# EAGLE design Arc Reactor (EAGLE 7.2.0)
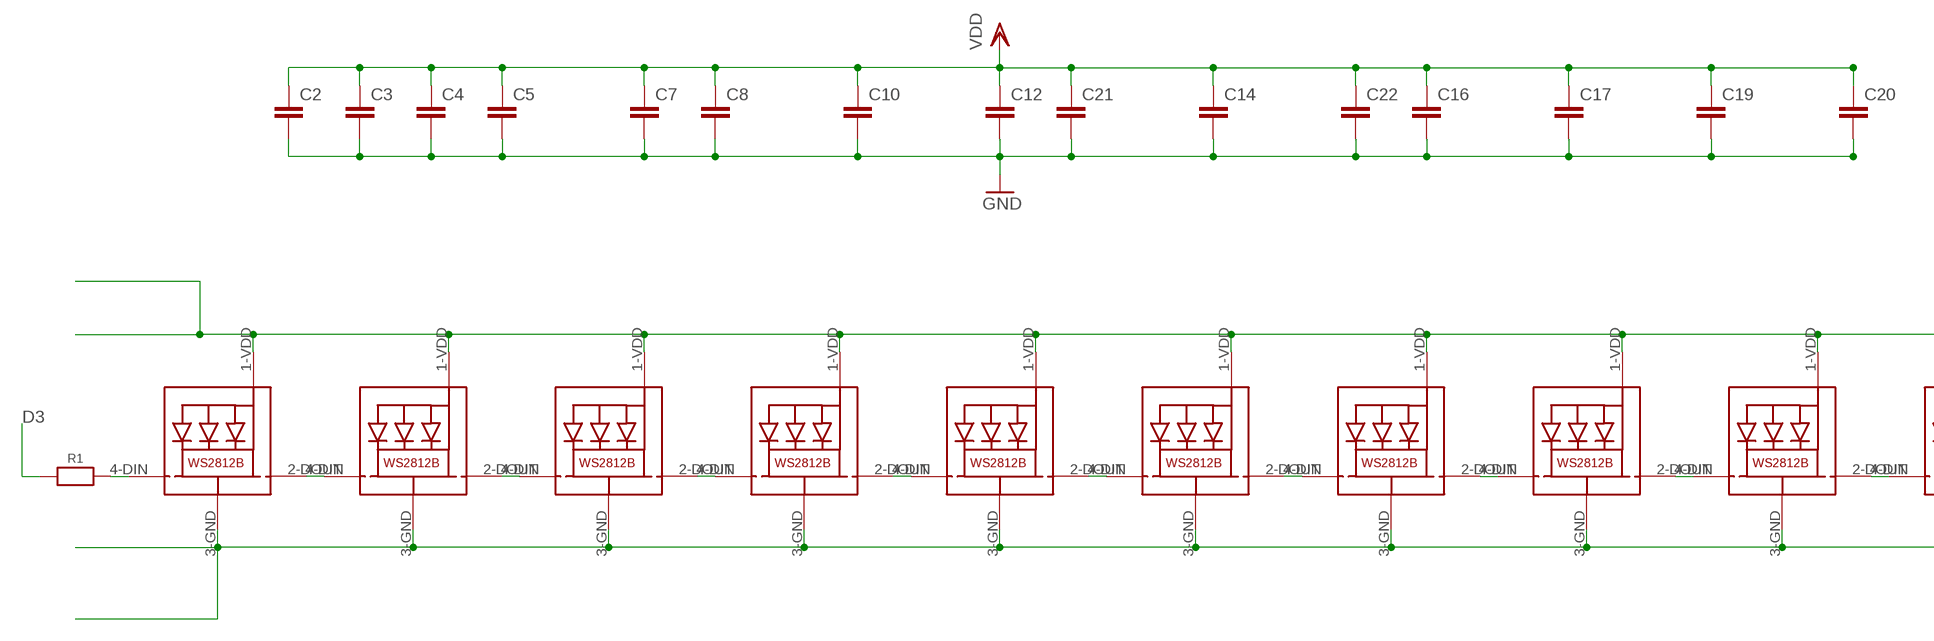
[diagram p0: schematic, sheet 1, part 1 of 2]
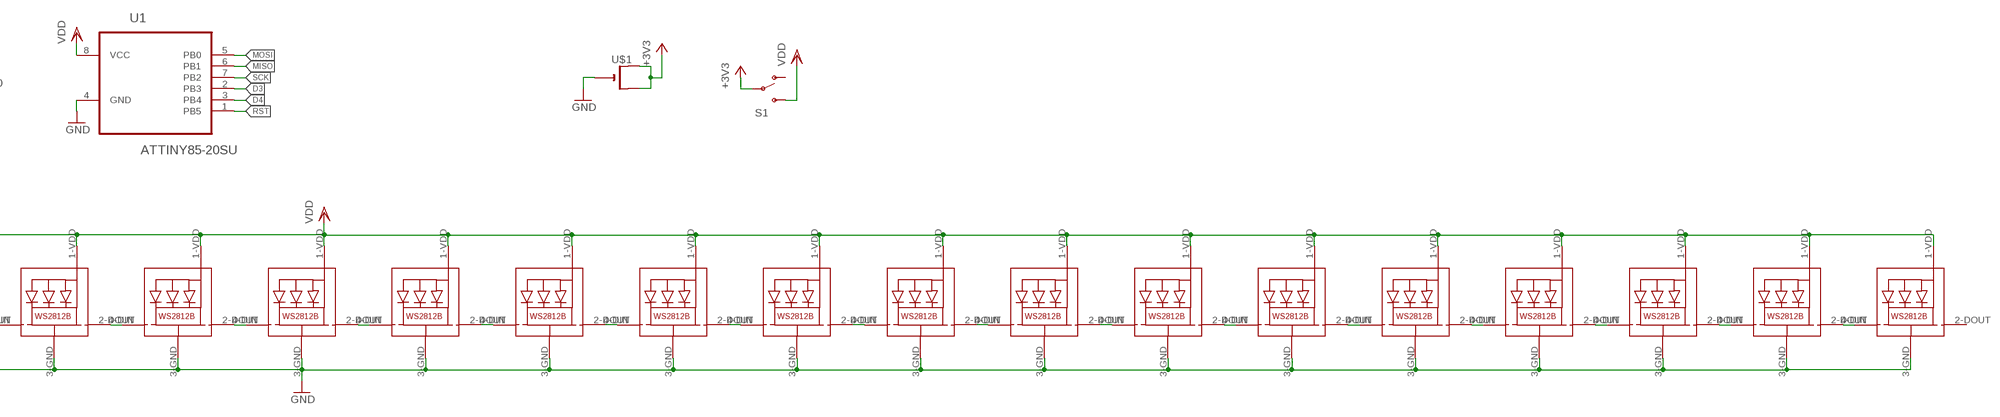
[diagram p1: schematic, sheet 1, part 2 of 2]

## Parts
C2  C-EUC0603  [C0603]
C3  C-EUC0603  [C0603]
C4  C-EUC0603  [C0603]
C5  C-EUC0603  [C0603]
C7  C-EUC0603  [C0603]
C8  C-EUC0603  [C0603]
C10  C-EUC0603  [C0603]
C12  C-EUC0603  [C0603]
C14  C-EUC0603  [C0603]
C16  C-EUC0603  [C0603]
C17  C-EUC0603  [C0603]
C19  C-EUC0603  [C0603]
C20  C-EUC0603  [C0603]
C21  C-EUC0603  [C0603]
C22  C-EUC0603  [C0603]
LED1  WS2812B5050  [WS2812B]
LED3  WS2812B5050  [WS2812B]
LED4  WS2812B5050  [WS2812B]
LED5  WS2812B5050  [WS2812B]
LED6  WS2812B5050  [WS2812B]
LED7  WS2812B5050  [WS2812B]
LED8  WS2812B5050  [WS2812B]
LED9  WS2812B5050  [WS2812B]
LED10  WS2812B5050  [WS2812B]
LED11  WS2812B5050  [WS2812B]
LED12  WS2812B5050  [WS2812B]
LED13  WS2812B5050  [WS2812B]
LED14  WS2812B5050  [WS2812B]
LED15  WS2812B5050  [WS2812B]
LED16  WS2812B5050  [WS2812B]
LED17  WS2812B5050  [WS2812B]
LED18  WS2812B5050  [WS2812B]
LED19  WS2812B5050  [WS2812B]
LED20  WS2812B5050  [WS2812B]
LED21  WS2812B5050  [WS2812B]
LED22  WS2812B5050  [WS2812B]
LED23  WS2812B5050  [WS2812B]
LED24  WS2812B5050  [WS2812B]
LED25  WS2812B5050  [WS2812B]
LED26  WS2812B5050  [WS2812B]
R1  RESISTOR_0603_NOOUT  [0603-NO]
S1  SWITCH-SPDTSMD2  [SWITCH-SPDT-SMD]
U1  ATTINY85-20SU  [SOIC127P798X216-8N]
U$1  CR2032SMT  [CR2032-SMD]

## Nets
+3V3: S1.2(P) U$1.+$1(+) U$1.+$2(+1)
D3: R1.1 U1.2(PB3)
D4: U1.3(PB4)
GND: C2.2 C3.2 C4.2 C5.2 C7.2 C8.2 C10.2 C12.2 C14.2 C16.2 C17.2 C19.2 C20.2 C21.2 C22.2 LED1.3-GND(GND) LED3.3-GND(GND) LED4.3-GND(GND) LED5.3-GND(GND) LED6.3-GND(GND) LED7.3-GND(GND) LED8.3-GND(GND) LED9.3-GND(GND) LED10.3-GND(GND) LED11.3-GND(GND) LED12.3-GND(GND) LED13.3-GND(GND) LED14.3-GND(GND) LED15.3-GND(GND) LED16.3-GND(GND) LED17.3-GND(GND) LED18.3-GND(GND) LED19.3-GND(GND) LED20.3-GND(GND) LED21.3-GND(GND) LED22.3-GND(GND) LED23.3-GND(GND) LED24.3-GND(GND) LED25.3-GND(GND) LED26.3-GND(GND) U1.4(GND) U$1.-
MISO: U1.6(PB1)
MOSI: U1.5(PB0)
N$1: LED1.2-DOUT(DO) LED3.4-DIN(DI)
N$2: LED3.2-DOUT(DO) LED4.4-DIN(DI)
N$3: LED4.2-DOUT(DO) LED5.4-DIN(DI)
N$4: LED5.2-DOUT(DO) LED6.4-DIN(DI)
N$5: LED6.2-DOUT(DO) LED7.4-DIN(DI)
N$6: LED7.2-DOUT(DO) LED8.4-DIN(DI)
N$7: LED8.2-DOUT(DO) LED9.4-DIN(DI)
N$8: LED9.2-DOUT(DO) LED10.4-DIN(DI)
N$9: LED10.2-DOUT(DO) LED11.4-DIN(DI)
N$10: LED11.2-DOUT(DO) LED12.4-DIN(DI)
N$11: LED12.2-DOUT(DO) LED13.4-DIN(DI)
N$12: LED13.2-DOUT(DO) LED14.4-DIN(DI)
N$13: LED14.2-DOUT(DO) LED15.4-DIN(DI)
N$14: LED15.2-DOUT(DO) LED16.4-DIN(DI)
N$15: LED16.2-DOUT(DO) LED17.4-DIN(DI)
N$16: LED17.2-DOUT(DO) LED18.4-DIN(DI)
N$17: LED18.2-DOUT(DO) LED19.4-DIN(DI)
N$18: LED19.2-DOUT(DO) LED20.4-DIN(DI)
N$19: LED20.2-DOUT(DO) LED21.4-DIN(DI)
N$20: LED21.2-DOUT(DO) LED22.4-DIN(DI)
N$21: LED22.2-DOUT(DO) LED23.4-DIN(DI)
N$22: LED23.2-DOUT(DO) LED24.4-DIN(DI)
N$23: LED24.2-DOUT(DO) LED25.4-DIN(DI)
N$24: LED25.2-DOUT(DO) LED26.4-DIN(DI)
N$25: LED1.4-DIN(DI) R1.2
RST: U1.1(PB5)
SCK: U1.7(PB2)
VDD: C2.1 C3.1 C4.1 C5.1 C7.1 C8.1 C10.1 C12.1 C14.1 C16.1 C17.1 C19.1 C20.1 C21.1 C22.1 LED1.1-VDD(VDD) LED3.1-VDD(VDD) LED4.1-VDD(VDD) LED5.1-VDD(VDD) LED6.1-VDD(VDD) LED7.1-VDD(VDD) LED8.1-VDD(VDD) LED9.1-VDD(VDD) LED10.1-VDD(VDD) LED11.1-VDD(VDD) LED12.1-VDD(VDD) LED13.1-VDD(VDD) LED14.1-VDD(VDD) LED15.1-VDD(VDD) LED16.1-VDD(VDD) LED17.1-VDD(VDD) LED18.1-VDD(VDD) LED19.1-VDD(VDD) LED20.1-VDD(VDD) LED21.1-VDD(VDD) LED22.1-VDD(VDD) LED23.1-VDD(VDD) LED24.1-VDD(VDD) LED25.1-VDD(VDD) LED26.1-VDD(VDD) S1.3(S) U1.8(VCC)
Unconnected: LED26.2-DOUT(DO) S1.1(O)

## Library data of the parts
C2-C5 C7 C8 C10 C12 C14 C16 C17 C19-C22 = rcl:C-EU: CAPACITOR, European symbol
LED1 LED3-LED26 = microbuilder:WS2812B5050
R1 = microbuilder:RESISTOR: Resistors For new designs, use the packages preceded by an '_' character since they are more reliable: The following footprints should be used on most boards: _0402 - Standard footprint for regular board layouts _0603 - Standard footprint for regular board layouts _0805 - Standard footprint for regular board layouts _1206 - Standard footprint for regular board layouts For extremely tight-pitch boards where space is at a premium, the following 'micro-pitch' footprints can be used (smaller pads, no silkscreen outline, etc.): _0402MP - Micro-pitch footprint for very dense/compact boards _0603MP - Micro-pitch footprint for very dense/compact boards _0805MP - Micro-pitch footprint for very dense/compact boards _1206MP - Micro-pitch footprint for very dense/compact boards
S1 = SparkFun-Electromechanical:SWITCH-SPDT: SPDT Switch Simple slide switch, Spark Fun Electronics SKU : COM-00102 DPDT SMT slide switch, AYZ0202, SWCH-08179
U1 = Atmel:ATTINY85-20SU: 8-bit Microcontroller with In-System Programmable Flash; MPN: ATTINY85-20SU; OC_FARNELL: 1455164; OC_NEWARK: 58M3797; PACKAGE: SOIC-8; SUPPLIER: Atmel
U$1 = adafruit:CR2032

## Board
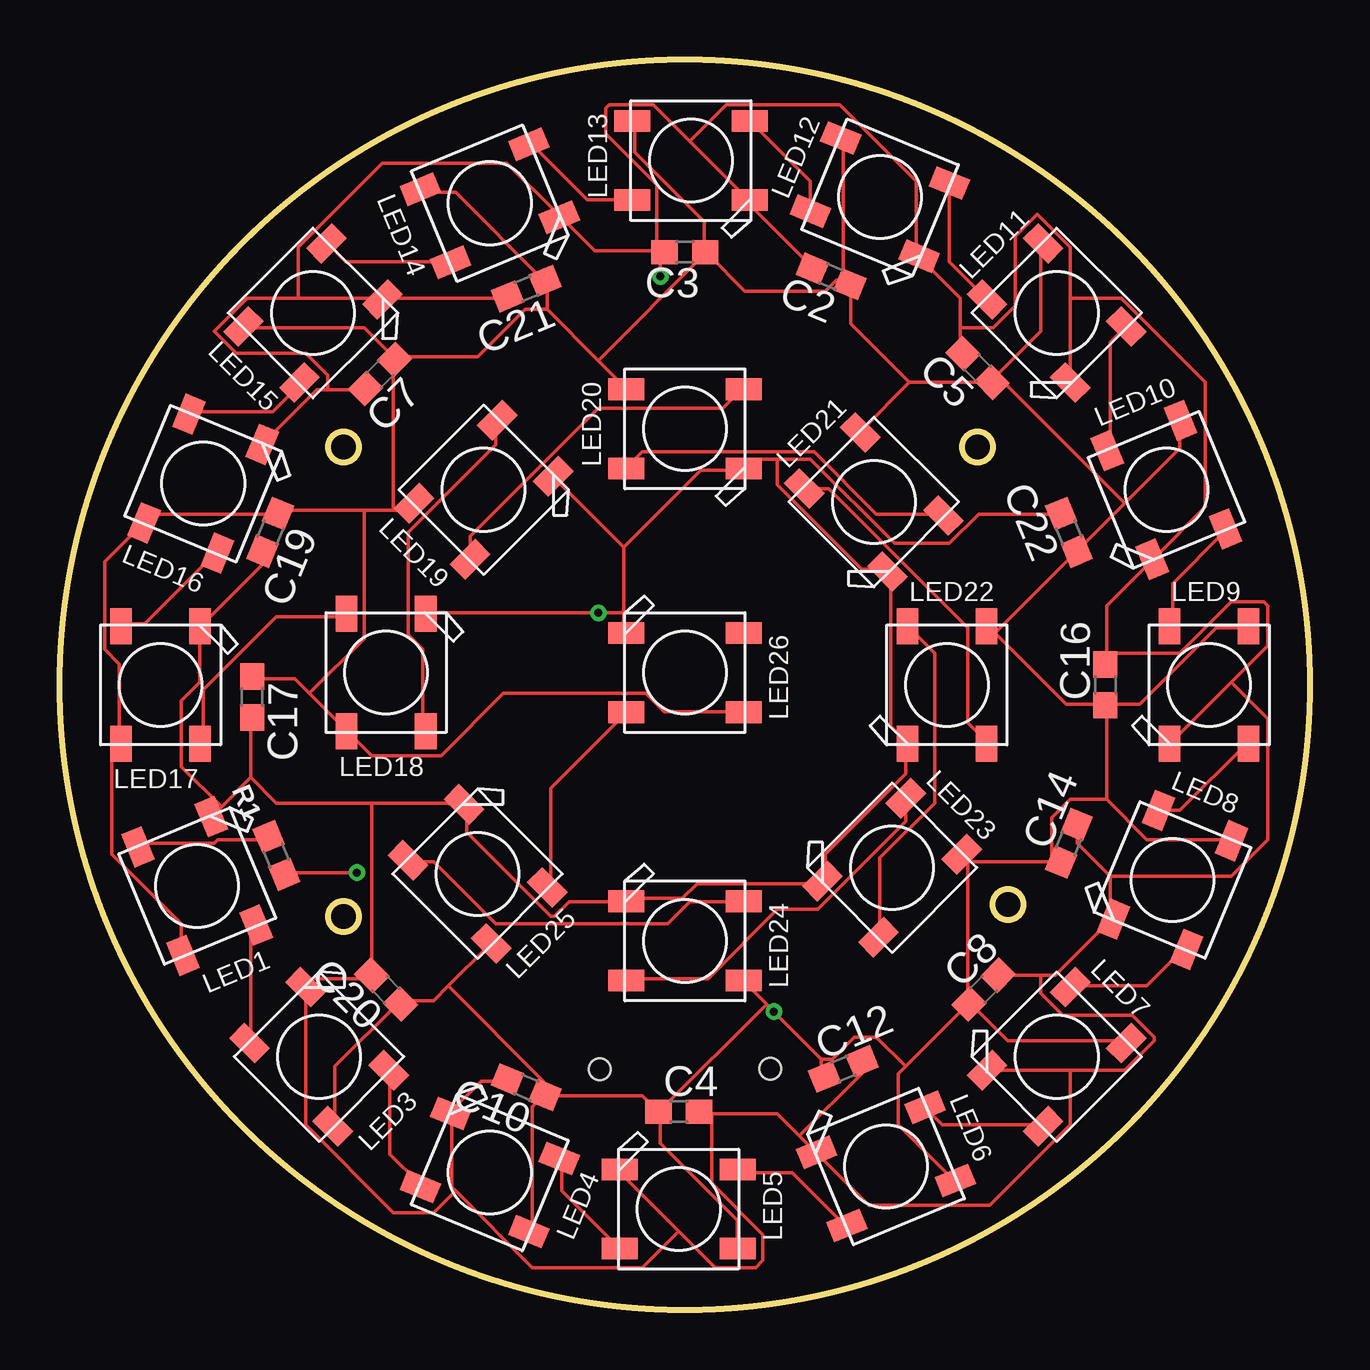
[diagram p2: board, top side]
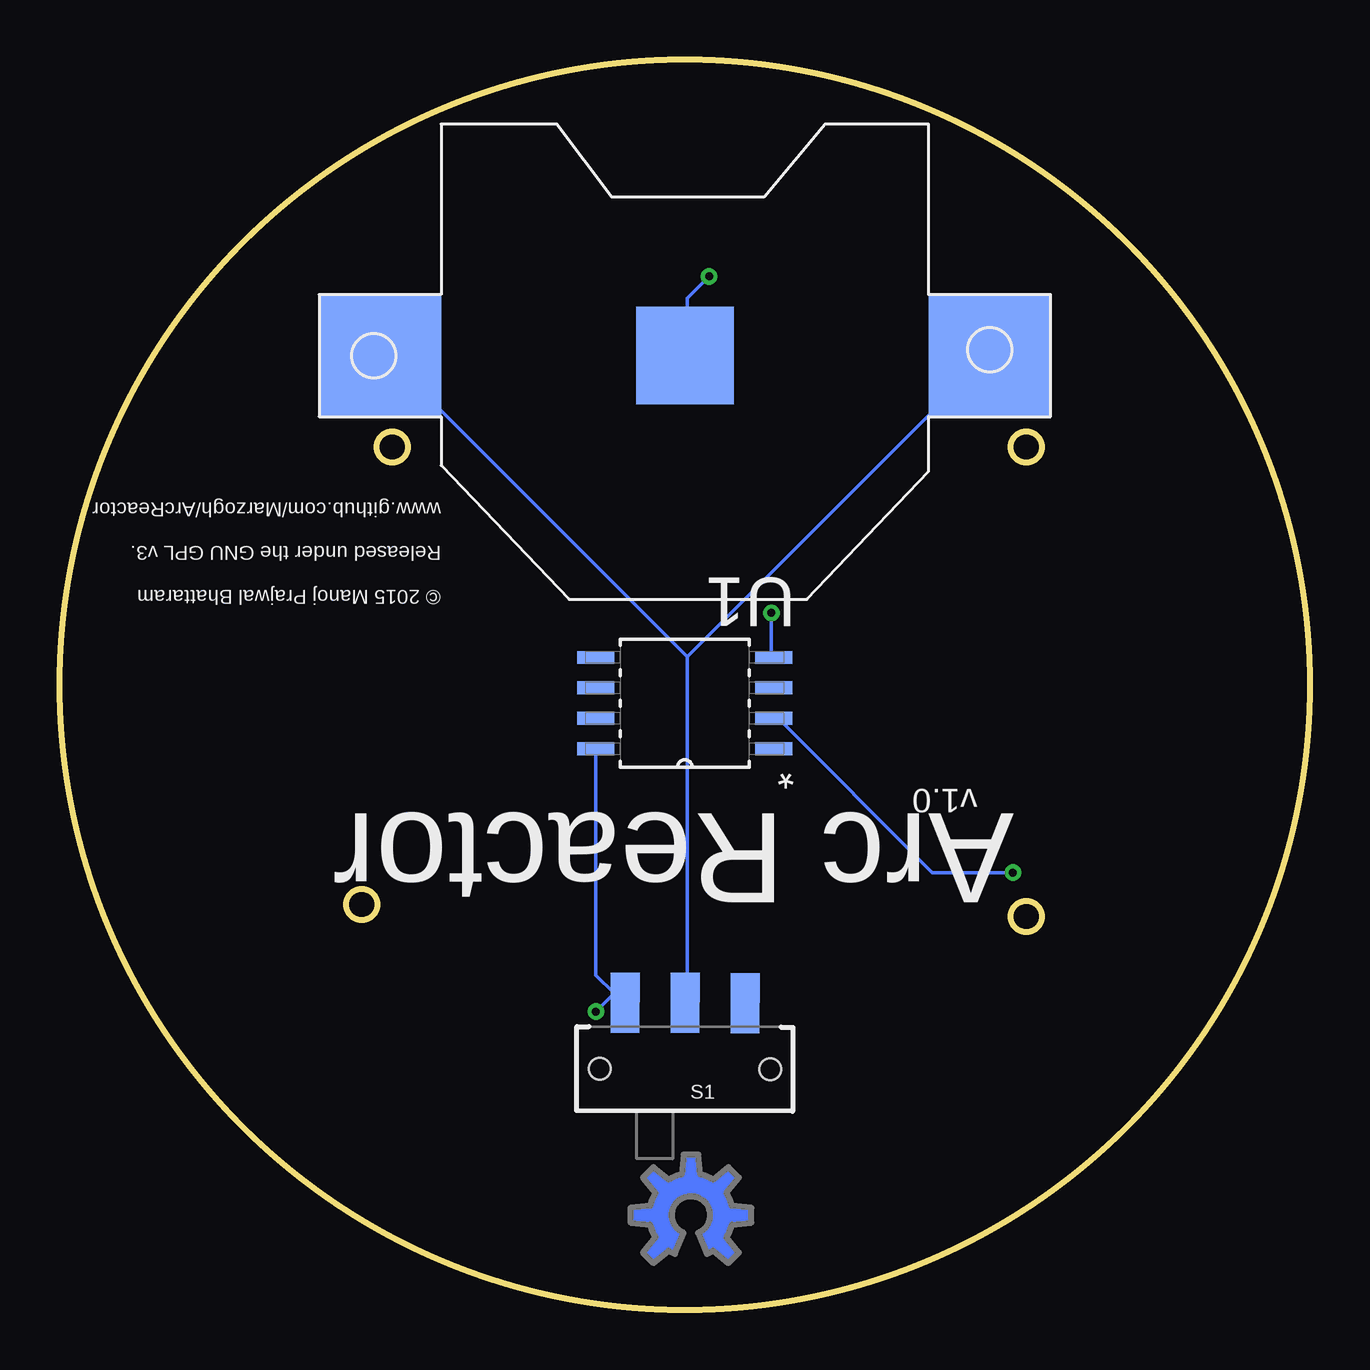
[diagram p3: board, bottom side, seen from below]

Size 52.07 x 52.07 mm. Coordinates in mm from the lower left corner, seen from the top.
Outline: circle at 26.04,26.04 radius 26.04
Copper layers (1*16): Top 0.0356mm / dielectric 1.5011mm / Bottom 0.0356mm
Design rules "OSHPark_Rules": minimum track width 6mil, minimum drill 13mil, track to track 6mil, track to pad 6mil, pad to pad 6mil, via to via 6mil, smd to smd 6mil, copper to edge 15mil, drill to drill 6mil, minimum pad ring 7mil, minimum via ring 7mil, stop-mask expansion 3mil, vias tented up to drill 0mil, thermal gap 10mil
Milling: area 11.2,35.3 to 12.4,36.6; area 11.2,15.7 to 12.4,17; area 37.6,35.3 to 38.9,36.6; area 38.9,16.3 to 40.1,17.5

### Footprints (pad centres in the part's own frame; a part is rotated, then mirrored left to right if it is on the bottom)
C0603 = smd 1.1 x 1: 1 -0.85,0; 2 0.85,0
WS2812B = smd 1.5 x 0.9: 1-VDD 2.45,-1.65; 2-DOUT 2.45,1.65; 3-GND -2.45,1.65; 4-DIN -2.45,-1.65
0603-NO = smd 1.1 x 1: 1 -0.85,0; 2 0.85,0
SWITCH-SPDT-SMD = smd 1.2 x 2.5: 1 -2.5,-2.75; 2 0,-2.75; 3 2.5,-2.75 | hole 0.9: -3.55,0; 3.55,0
SOIC127P798X216-8N = smd 1.549 x 0.533: 1 -3.708,1.905; 2 -3.708,0.635; 3 -3.708,-0.635; 4 -3.708,-1.905; 5 3.708,-1.905; 6 3.708,-0.635; 7 3.708,0.635; 8 3.708,1.905
CR2032-SMD = smd 5.08 x 5.08: +$1 -12.7,0; +$2 12.7,0 | smd 4.064 x 4.064: - 0,0

### Placement (x,y rotation side)
C2  32.13,43.05 157.5 top
C3  26.04,44.07 180 top
C4  25.78,8.25 0 top
C5  38.23,39.24 135 top
C7  13.34,38.99 225 top
C8  38.48,13.33 45 top
C10  19.43,9.27 157.5 top
C12  32.64,10.03 22.5 top
C14  42.04,19.43 67.5 top
C16  43.56,26.04 90 top
C17  8,25.53 270 top
C19  8.76,32.38 247.5 top
C20  13.59,13.33 135 top
C21  19.43,42.55 202.5 top
C22  42.04,32.38 112.5 top
LED1  5.72,17.65 292.5 top
LED3  10.8,10.54 315 top
LED4  17.91,5.71 337.5 top
LED5  25.78,4.19 0 top
LED6  34.42,5.97 22.5 top
LED7  41.53,10.54 45 top
LED8  46.36,17.91 67.5 top
LED9  47.88,26.04 90 top
LED10  46.1,34.16 112.5 top
LED11  41.53,41.53 135 top
LED12  34.16,46.35 157.5 top
LED13  26.29,47.88 180 top
LED14  17.91,46.1 202.5 top
LED15  10.54,41.53 225 top
LED16  5.97,34.42 247.6 top
LED17  4.19,26.04 270 top
LED18  13.59,26.54 270 top
LED19  17.65,34.16 225 top
LED20  26.04,36.7 180 top
LED21  33.91,33.66 135 top
LED22  36.96,26.04 90 top
LED23  34.67,18.41 45 top
LED24  26.04,15.37 0 top
LED25  17.4,18.16 315 top
LED26  26.04,26.54 0 top
R1  9.02,18.92 112.5 top
S1  26.04,10.03 179.8 bottom
U1  26.04,25.27 180 bottom
U$1  26.04,39.75 0 bottom
U$2  [OSHWLOGO_TOP_0.2]  25.78,3.94 0 bottom

### Tracks (layer width: path | path; a pad name or v marks a point on that pad's centre or on a via)
+3V3
  Bottom 0.152: 25.93,27.2 25.93,12.88 S1.2 | 25.93,27.2 13.44,39.7 U$1.+$2 | 25.93,27.2 38.43,39.7 38.73,39.7 U$1.+$1
D3  (via drill 0.33)
  Top 0.152: v12.37,18.21 9.47,18.21 R1.1
  Bottom 0.152: v12.37,18.21 15.72,18.21 22.28,24.77 U1.2
GND  (via drill 0.33)
  Top 0.152: C21.2 18.62,42.14 13.59,42.14 LED15.3-GND 13.44,42.14 9.93,42.14 | 11.15,38.33 10.69,38.33 8.56,36.2 LED16.3-GND | 11.15,38.33 12.68,38.33 C7.2 | 9.93,42.14 7.8,42.14 6.43,40.77 7.34,39.85 10.24,39.85 11.15,38.94 11.15,38.33 | 37.52,40.92 37.52,42.14 35.84,43.81 LED12.3-GND 35.69,43.97 35.69,47.02 32.49,50.22 27.76,50.22 26.24,48.69 | 37.52,40.92 37.52,39.85 C5.2 | 42.09,42.14 42.09,44.27 40.72,45.64 39.8,44.73 39.8,41.83 38.89,40.92 37.52,40.92 | 42.09,42.14 LED11.3-GND | C2.2 31.27,43.51 28.68,46.1 LED13.3-GND 28.68,46.25 26.24,48.69 | 24.87,44.12 22.28,44.12 20.9,45.49 LED14.3-GND 20.75,45.64 18.62,47.78 13.44,47.78 9.93,44.27 9.93,42.14 | 24.87,44.12 25.02,44.12 | 25.02,44.12 25.17,44.12 C3.2 | 26.24,48.69 24.71,50.22 22.89,50.22 22.73,50.06 22.73,49 24.87,46.86 24.87,44.12 | 24.87,44.12 C3.2 | 25.02,44.12 v25.02,43.05 | 25.02,44.12 C3.2 | 29.9,35.43 28.83,35.43 28.52,35.13 LED20.3-GND 28.37,34.98 26.7,34.98 23.5,31.77 | 29.9,35.43 31.27,35.43 34.77,31.93 37.06,31.93 38.28,33.15 41.63,33.15 C22.2 | 23.5,31.77 23.5,29.03 | 23.5,29.03 23.5,28.27 LED26.3-GND | 23.5,31.77 20.6,34.67 LED19.3-GND | 23.5,29.03 v22.43,29.03 15.27,29.03 LED18.3-GND | 29.9,35.43 29.9,34.37 33.4,30.86 34.47,30.86 LED21.3-GND 34.62,30.71 34.62,24.31 35.23,23.7 LED22.3-GND 35.23,23.55 35.23,22.33 31.88,18.97 31.88,17.91 LED23.3-GND 31.73,17.75 26.54,17.75 25.93,17.14 23.65,17.14 LED24.3-GND 23.5,16.99 21.21,16.99 20.6,16.38 20.45,16.38 16.94,19.89 16.94,20.95 LED25.3-GND 16.79,21.11 12.98,21.11 | 43.61,27.36 43.61,29.34 45.44,31.17 LED10.3-GND 45.59,31.32 47.73,33.45 47.73,38.63 44.22,42.14 42.09,42.14
  Top 0.152: 43.61,27.36 43.61,26.9 C16.2 43.61,27.36 | 48.79,26.14 50.32,27.66 50.32,29.34 50.17,29.49 48.79,29.49 46.66,27.36 43.61,27.36 | 48.79,26.14 46.36,23.7 LED9.3-GND | 40.87,13.95 41.48,13.95 43.76,16.23 LED8.3-GND 43.76,16.38 43.76,18.06 | 40.87,13.95 39.19,13.95 C8.2 | 43.76,18.06 42.39,19.43 42.39,20.19 C14.2 | 42.09,9.98 44.37,9.98 45.59,11.2 45.59,11.35 44.68,12.27 41.78,12.27 40.87,13.18 40.87,13.95 | 42.09,9.98 38.73,9.98 LED7.3-GND | 48.79,26.14 50.32,24.61 50.32,19.58 48.79,18.06 43.76,18.06 | C10.2 18.62,9.53 17.55,9.53 16.33,8.31 LED4.3-GND 16.33,8.15 16.33,5.1 16.48,4.95 | 27.15,8.15 29.9,8.15 30.81,7.24 | 27.15,8.15 26.7,8.15 C4.2 27.15,8.15 | 30.81,7.24 31.42,6.63 LED6.3-GND 31.57,6.48 33.71,4.34 38.73,4.34 42.09,7.7 42.09,9.98 | 30.81,7.24 33.4,9.83 33.4,10.29 C12.2 | 25.78,3.28 27.3,1.75 28.98,1.75 29.29,2.06 29.29,3.12 27.15,5.26 27.15,8.15 | 25.78,3.28 23.34,5.71 LED5.3-GND | 16.48,4.95 19.69,1.75 24.26,1.75 25.78,3.28 | C19.2 8.41,31.47 8.41,31.01 5.97,28.57 LED17.3-GND 5.82,28.42 5.82,26.14 5.06,25.38 5.06,22.63 6.73,20.95 | 7.95,22.17 7.95,24.61 C17.2 | 6.73,20.95 6.43,20.65 LED1.3-GND | 6.73,20.95 7.95,22.17 | 12.98,21.11 9.02,21.11 7.95,22.17 | 12.98,21.11 C20.2 12.98,13.79 10.54,13.79 10.24,13.49 LED3.3-GND 10.24,13.33 10.24,7.7 13.89,4.04 15.57,4.04 16.48,4.95
  Bottom 0.152: v25.02,43.05 25.93,42.14 25.93,39.85 U$1.- | v22.43,29.03 22.43,27.2 U1.4
N$1
  Top 0.152: LED3.4-DIN 7.95,11.2 7.95,15.77 8.1,15.93 LED1.2-DOUT
N$2
  Top 0.152: LED3.2-DOUT 13.74,9.83 13.74,6.48 14.96,5.26 LED4.4-DIN
N$3
  Top 0.152: LED4.2-DOUT 20.9,6.17 20.9,4.95 23.19,2.67 LED5.4-DIN
N$4
  Top 0.152: LED5.2-DOUT 28.37,5.71 30.51,5.71 32.64,3.58 LED6.4-DIN
N$5
  Top 0.152: LED7.4-DIN 40.87,7.7 36.75,7.7 36.14,8.31 LED6.2-DOUT
N$6
  Top 0.152: LED7.2-DOUT 42.24,13.49 45.29,13.49 46.81,15.01 LED8.4-DIN
N$7
  Top 0.152: LED8.2-DOUT 45.9,20.8 46.66,20.8 49.4,23.55 LED9.4-DIN
N$8
  Top 0.152: LED9.2-DOUT 46.36,28.57 46.36,30.25 48.49,32.38 LED10.4-DIN
N$9
  Top 0.152: LED10.2-DOUT 43.76,35.89 43.76,40.31 44.37,40.92 LED11.4-DIN
N$10
  Top 0.152: LED12.4-DIN 37.06,46.86 37.06,43.66 38.58,42.14 LED11.2-DOUT
N$11
  Top 0.152: LED12.2-DOUT 31.27,45.8 31.27,47.02 28.83,49.45 LED13.4-DIN
N$12
  Top 0.152: LED13.2-DOUT 23.8,46.25 21.97,46.25 19.69,48.54 LED14.4-DIN
N$13
  Top 0.152: LED14.2-DOUT 16.18,43.66 11.91,43.66 11.15,44.42 LED15.4-DIN
N$14
  Top 0.152: LED16.4-DIN 5.51,37.41 8.87,37.41 9.93,38.48 LED15.2-DOUT
N$15
  Top 0.152: LED17.4-DIN 2.62,28.57 3.53,28.57 6.43,31.47 LED16.2-DOUT
N$16
  Top 0.152: LED17.2-DOUT 5.97,23.7 5.97,25.83 9.02,28.88 11.91,28.88 LED18.4-DIN
N$17
  Top 0.152: LED18.2-DOUT 15.11,24.16 15.11,27.51 14.5,28.12 14.5,32.38 18.16,36.04 18.16,36.96 LED19.4-DIN
N$18
  Top 0.152: LED19.2-DOUT 17.09,31.32 17.09,32.23 22.43,37.57 27.61,37.57 28.37,38.33 LED20.4-DIN
N$19
  Top 0.152: LED21.4-DIN 36.75,33.15 34.01,33.15 31.42,35.74 24.26,35.74 23.65,35.13 LED20.2-DOUT
N$20
  Top 0.152: LED21.2-DOUT 31.12,34.21 32.03,34.21 37.82,28.42 37.82,24.46 38.58,23.7 LED22.4-DIN
N$21
  Top 0.152: LED23.4-DIN 34.16,15.62 34.16,18.82 36.45,21.11 36.45,27.36 35.38,28.42 LED22.2-DOUT
N$22
  Top 0.152: LED24.4-DIN 23.65,13.79 27,13.79 29.9,16.69 31.57,16.69 35.23,20.34 35.23,21.26 LED23.2-DOUT
N$23
  Top 0.152: LED24.2-DOUT 28.37,16.99 26.24,16.99 25.32,16.08 18.16,16.08 15.57,18.67 14.5,18.67 LED25.4-DIN
N$24
  Top 0.152: LED25.2-DOUT 20.45,17.6 20.45,21.72 23.5,24.77 LED26.4-DIN
N$25
  Top 0.152: R1.2 8.56,19.58 6.58,19.58 6.43,19.43 3.38,19.43 LED1.4-DIN
VDD  (via drill 0.33)
  Top 0.152: 16.18,13.49 17.86,15.16 LED25.1-VDD | 16.18,13.49 15.57,12.88 14.2,12.88 C20.1 14.05,12.72 11.46,10.13 11.46,7.7 LED3.1-VDD | C10.1 20.3,8.91 24.26,8.91 24.87,8.31 C4.1 | LED4.1-VDD 19.69,3.28 19.69,8.46 20.14,8.91 C10.1 | LED5.1-VDD 28.22,2.67 28.22,3.73 25.02,6.93 25.02,8.15 C4.1 | 16.18,13.49 20.14,9.53 20.14,9.07 C10.1 | 38.89,28.27 38.73,28.42 LED22.1-VDD 38.89,28.27 | 38.89,28.27 41.94,25.22 43.46,25.22 C16.1 | 38.89,28.27 39.04,28.27 42.24,31.47 C22.1 42.39,31.62 44.37,33.6 | 43.61,21.26 45.29,19.58 48.79,19.58 LED8.1-VDD | 43.61,21.26 43.61,25.07 C16.1 | LED9.1-VDD 49.4,28.42 48.18,28.42 44.98,25.22 43.61,25.22 C16.1 | 44.37,33.6 46.66,35.89 46.66,36.96 LED10.1-VDD | 31.73,10.44 31.73,9.83 C12.1 | 29.44,12.72 28.52,13.64 LED24.1-VDD | 29.44,12.72 v29.74,12.42 31.73,10.44 | 37.82,18.67 37.82,18.82 37.67,18.97 LED23.1-VDD 37.82,18.67 | 37.82,18.67 37.82,12.88 C8.1 | 37.82,18.67 41.33,18.67 | 41.33,18.67 41.63,18.67 C14.1 41.33,18.67 | 35.23,10.13 37.82,12.72 C8.1 | 35.23,10.13 34.92,9.83 34.92,7.7 37.21,5.41 LED6.1-VDD | LED7.1-VDD 44.37,11.2 39.5,11.2 37.97,12.72 C8.1 | 31.73,10.44 32.18,10.44 33.1,11.35 34.01,11.35 35.23,10.13 | 43.61,21.26 42.09,21.26 41.33,20.5 41.33,18.67 | 29.44,12.72 25.02,8.31 C4.1 | 35.38,38.63 38.73,38.63 C5.1 | 35.38,38.63 33.4,36.65 LED21.1-VDD | 35.38,38.63 32.94,41.07 32.94,42.6 C2.1 | 39.04,38.94 38.89,38.79 C5.1 | 39.04,38.94 40.87,40.77 40.87,44.42 LED11.1-VDD | 32.64,42.9 32.64,48.69 LED12.1-VDD | 32.64,42.9 32.79,42.75 C2.1 | 20.3,41.68 20.3,42.75 C21.1 20.14,42.9 16.48,46.56 15.11,46.56 LED14.1-VDD | 22.43,39.55 23.5,38.48 LED20.1-VDD
  Top 0.152: 22.43,39.55 20.3,41.68 | 22.43,39.55 26.85,43.97 C3.1 | LED13.1-VDD 23.95,49.45 23.95,48.23 26.85,45.34 26.85,44.12 C3.1 | 32.64,42.9 32.33,42.9 31.88,42.44 28.52,42.44 27,43.97 C3.1 | 32.64,42.9 C2.1 | 10.39,25.68 11.91,24.16 LED18.1-VDD 12.07,24 12.98,23.09 15.88,23.09 18.47,25.68 24.41,25.68 25.17,24.92 28.37,24.92 LED26.1-VDD | 10.39,25.68 9.78,26.29 8.1,26.29 C17.1 | 13.89,33.3 14.5,33.3 14.66,33.45 LED19.1-VDD | 13.89,33.3 12.68,33.3 | 12.68,33.3 9.17,33.3 C19.1 9.02,33.15 3.84,33.15 3.53,32.84 LED16.1-VDD 3.38,32.69 1.85,31.17 1.85,27.51 2.46,26.9 2.46,23.7 LED17.1-VDD 2.46,23.55 2.16,23.24 2.16,18.97 5.06,16.08 5.06,14.86 LED1.1-VDD | 13.89,33.3 13.89,39.55 C7.1 | LED15.1-VDD 7.65,40.92 12.68,40.92 13.89,39.7 C7.1 | 10.39,25.68 12.68,27.96 12.68,33.3 | 20.3,41.68 19.38,41.68 17.4,39.7 14.05,39.7 C7.1 | 39.04,38.94 44.37,33.6 | 39.04,38.94 C5.1
  Bottom 0.152: U1.8 29.74,13.95 28.98,13.18 | 28.98,13.18 28.68,12.88 S1.3 28.98,13.18 | v29.74,12.42 28.98,13.18

### Text on the board
_bsilk: © 2015 Manoj Prajwal Bhattaram / / Released under the GNU GPL v3. / / www.github.com/Marzogh/ArcReactor | v1.0 | Arc Reactor